# EAGLE design blinken-v2 (EAGLE 6.6.0)
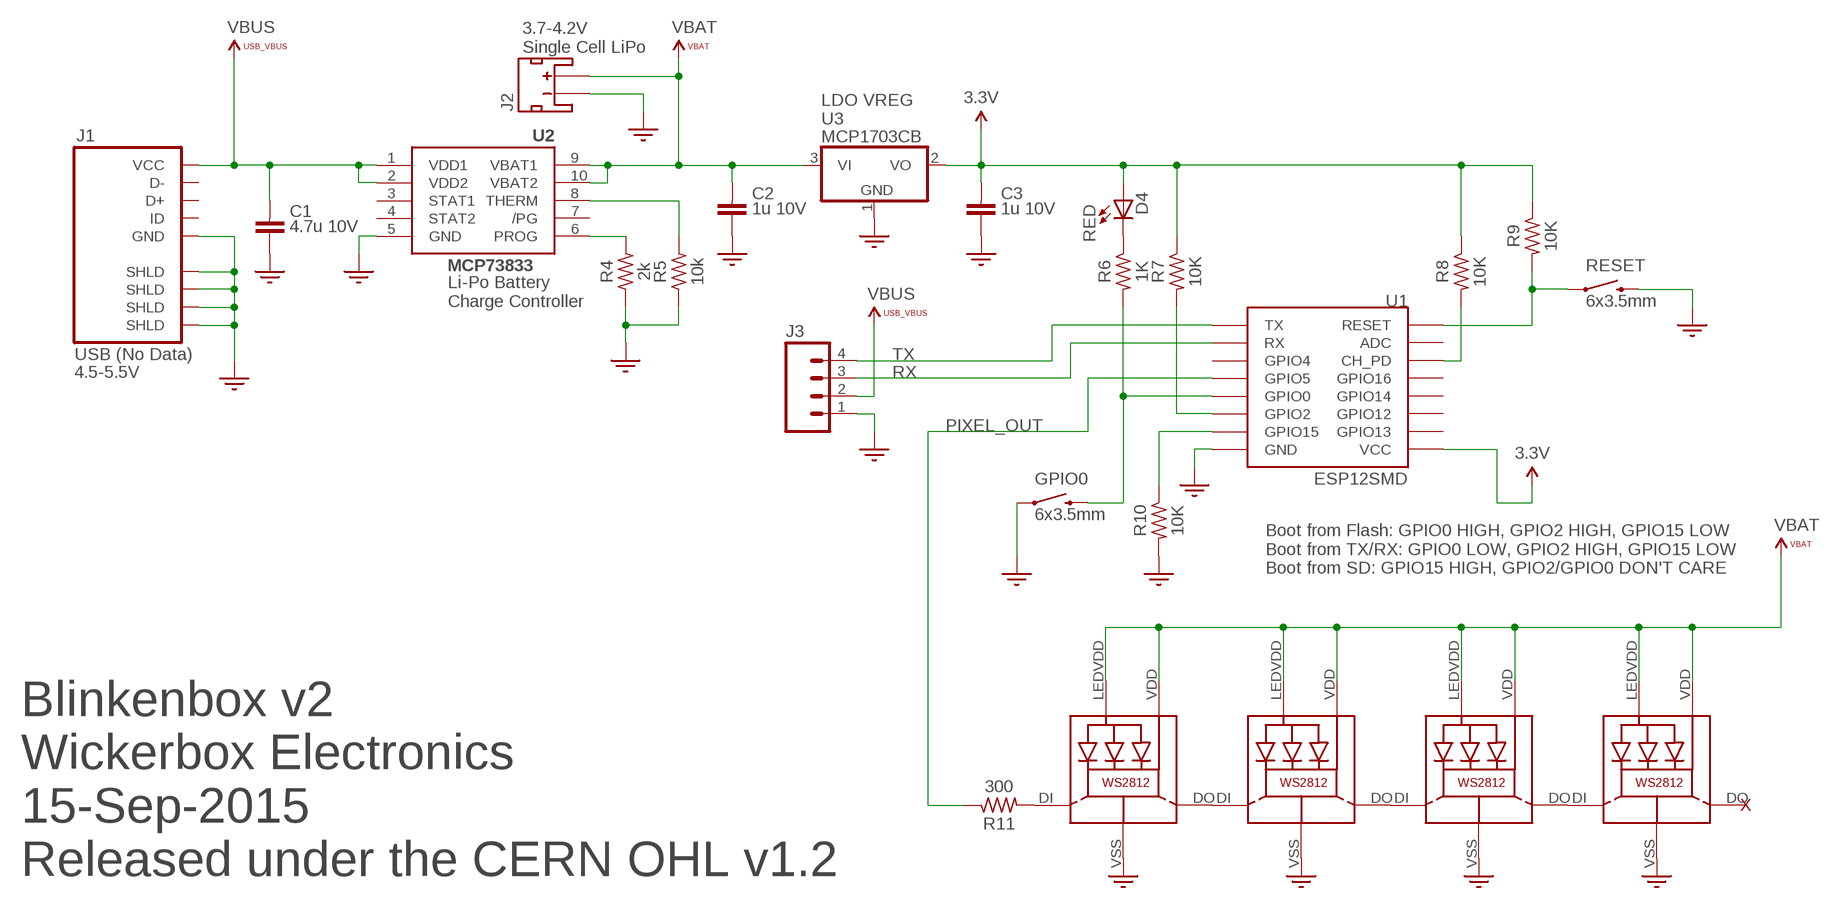
[diagram p0: schematic, sheet 1]

## Parts
C1  4.7u 10V  CAP-0805  [RLC-0805]
C2  1u 10V  CAP-0603  [RLC-0603]
C3  1u 10V  CAP-0603  [RLC-0603]
D4  RED  BG1111C  [LED0603]
GPIO0  6x3.5mm  SWITCH-MOMENTARY-2SMD-1101NE  [TACTILE-SWITCH-1101NE]
J1  USB (No Data)  ZX62D-B-5P8  [ZX62D-B-5P8]
J2  JST_2MM_MALE  [JST-2-SMD]
J3  M041X04_NO_SILK  [1X04_NO_SILK]
LED1  WS2812  [WS2812]
LED2  WS2812  [WS2812]
LED3  WS2812  [WS2812]
LED4  WS2812  [WS2812]
R4  2k  RES-0402  [RLC-0402]
R5  10k  RES-0402  [RLC-0402]
R6  1K  RES-0402  [RLC-0402]
R7  10K  RES-0402  [RLC-0402]
R8  10K  RES-0402  [RLC-0402]
R9  10K  RES-0402  [RLC-0402]
R10  10K  RES-0402  [RLC-0402]
R11  300  RES-0402  [RLC-0402]
RESET  6x3.5mm  SWITCH-MOMENTARY-2SMD-1101NE  [TACTILE-SWITCH-1101NE]
U1  ESP12SMD  [ESP12_SMD]
U2  MCP73833-UN  [MSOP10]
U3  MCP1703CB  [SOT23]

## Nets
3.3V: C3.2 D4.A R7.1 R8.1 R9.1 U1.VCC U3.2(VO)
!RESET: R9.2 RESET.1 U1.RESET
CH_PD: R8.2 U1.CH_PD
GND: C1.2 C2.1 C3.1 GPIO0.1 J1.P5(GND) J1.P$1(SHLD) J1.P$2(SHLD) J1.P$3(SHLD) J1.P$4(SHLD) J2.1(-) J3.1 LED1.VSS(GND) LED2.VSS(GND) LED3.VSS(GND) LED4.VSS(GND) R4.1 R5.1 R10.2 RESET.2 U1.GND U2.5(GND) U3.1(GND)
GPIO0: GPIO0.2 R6.2 U1.GPIO0
GPIO2: R7.2 U1.GPIO2
GPIO15: R10.1 U1.GPIO15
N$2: LED1.DO LED2.DI
N$3: D4.C R6.1
N$4: LED2.DO LED3.DI
N$5: LED3.DO LED4.DI
N$7: LED1.DI R11.2
PIXEL_OUT: R11.1 U1.GPIO5
PROG: R4.2 U2.6(PROG)
RX: J3.3 U1.RX
THERM: R5.2 U2.8(THERM)
TX: J3.4 U1.TX
VBROUTE: C2.2 J2.2(+) LED1.LEDVDD LED1.VDD LED2.LEDVDD LED2.VDD LED3.LEDVDD LED3.VDD LED4.LEDVDD LED4.VDD U2.9(VBAT1) U2.10(VBAT2) U3.3(VI) ; supply symbol labelled VBAT
VBUS: C1.1 J1.P1(VCC) J3.2 U2.1(VDD1) U2.2(VDD2)
Unconnected: J1.P2(D-) J1.P3(D+) J1.P4(ID) J2.NC1(PAD1) J2.NC2(PAD2) LED4.DO U1.ADC U1.GPIO4 U1.GPIO12 U1.GPIO13 U1.GPIO14 U1.GPIO16 U2.3(STAT1) U2.4(STAT2) U2.7(/PG)

## Notes on the sheet
- 3.7-4.2V
  Single Cell LiPo
- LDO VREG
- Li-Po Battery
  Charge Controller
- 4.5-5.5V
- Boot from Flash: GPIO0 HIGH, GPIO2 HIGH, GPIO15 LOW
  Boot from TX/RX: GPIO0 LOW, GPIO2 HIGH, GPIO15 LOW
  Boot from SD: GPIO15 HIGH, GPIO2/GPIO0 DON'T CARE
- X
- Blinkenbox v2
  Wickerbox Electronics
  15-Sep-2015
  Released under the CERN OHL v1.2

## Library data of the parts
C1 = max-viz:CAP-0805
C2 C3 = max-viz:CAP-0603
D4 = max-viz:BG1111C
GPIO0 RESET = SparkFun-Electromechanical:SWITCH-MOMENTARY-2: Various NO switches- pushbuttons, reed, etc; PROD_ID: SWCH-00815
J1 = con-hirose-microusb:ZX62D-B-5P8
J2 = SparkFun-Connectors:JST_2MM_MALE: Mates to single-cell LiPo batteries. CONN-08352; PROD_ID: CONN-08352
J3 = SparkFun-Connectors:M04: Header 4 Standard 4-pin 0.1" header. Use with straight break away headers (SKU : PRT-00116), right angle break away headers (PRT-00553), swiss pins (PRT-00743), machine pins (PRT-00117), and female headers (PRT-00115). Molex polarized connector foot print use with SKU : PRT-08231 with associated crimp pins and housings. 1MM SMD Version SKU: PRT-10208
LED1-LED4 = adafruit:WS2812
R4-R11 = max-viz:RES-0402
U1 = esp8266modules:ESP12: ESP8266 Wifi module 12
U2 = adafruit:MCP73833
U3 = linear:MCP1703: 250 mA, 16V, Low Quiescent Current LDO Regulator Source: http://ww1.microchip.com/downloads/en/DeviceDoc/22049b.pdf

## Board
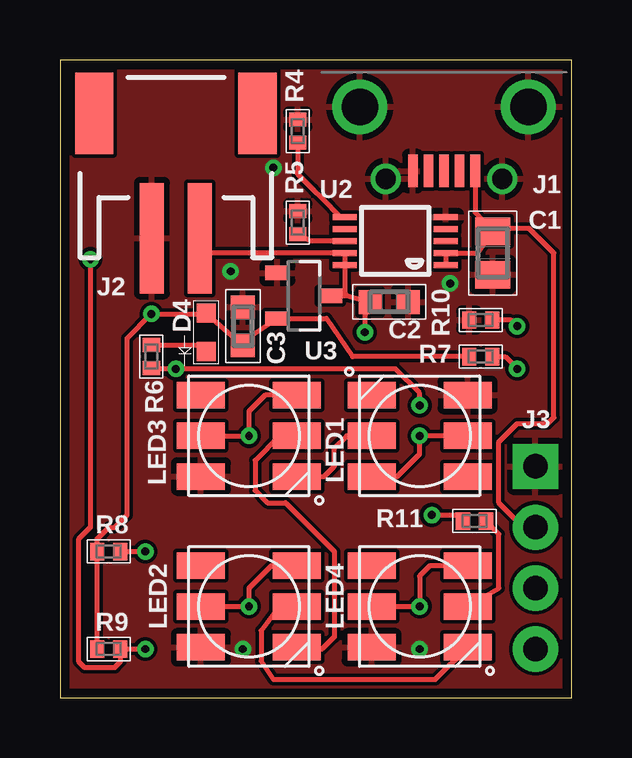
[diagram p1: board, top side]
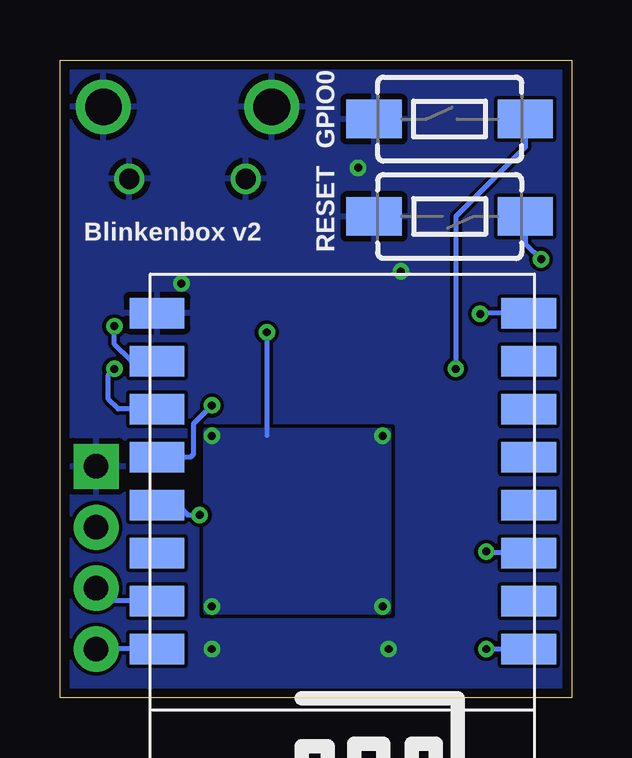
[diagram p2: board, bottom side, seen from below]

Size 21.32 x 26.59 mm. Coordinates in mm from the lower left corner, seen from the top.
Outline: 0,0 21.32,0 21.32,26.59 0,26.59 0,0
Copper layers (1*16): Top 0.0356mm / dielectric 1.5011mm / Bottom 0.0356mm
Design rules "oshpark-2layer": minimum track width 6mil, minimum drill 13mil, track to track 6mil, track to pad 6mil, pad to pad 6mil, via to via 6mil, smd to smd 6mil, copper to edge 15mil, drill to drill 6mil, minimum pad ring 7mil, minimum via ring 7mil, stop-mask expansion 4mil, vias tented up to drill 0mil, thermal gap 10mil

### Footprints (pad centres in the part's own frame; a part is rotated, then mirrored left to right if it is on the bottom)
RLC-0805 = smd 1.15 x 1.45: 1 -0.9,0; 2 0.9,0
RLC-0603 = smd 0.95 x 1: 1 0.8,0; 2 -0.8,0
LED0603 = smd 0.8 x 0.8: A 0,0.8; C 0,-0.8
TACTILE-SWITCH-1101NE = smd 2.3 x 1.6: 1 -3.15,0; 2 3.15,0
ZX62D-B-5P8 = smd 0.4 x 1.35: P1 -1.3,2.675; P2 -0.65,2.675; P3 0,2.675; P4 0.65,2.675; P5 1.3,2.675 | drill 1.524: P$1 3.51,0; P$2 -3.51,0 | drill 0.838: P$3 -2.425,3; P$4 2.425,3
JST-2-SMD = smd 1 x 4.6: 1 -1,-3.7; 2 1,-3.7 | smd 1.6 x 3.4: NC1 -3.4,1.5; NC2 3.4,1.5
1X04_NO_SILK = drill 1.016 pad 1.88 square: 1 0,0 | drill 1.016 pad 1.88: 2 2.54,0; 3 5.08,0; 4 7.62,0
WS2812 = smd 2 x 1.1: DI 2,0; DO 2,-1.7; LEDVDD -2,0; NC -2,1.7; VDD 2,1.7; VSS -2,-1.7
RLC-0402 = smd 0.59 x 0.72: 1 -0.48,0; 2 0.48,0
ESP12_SMD = smd 2.286 x 1.27: ADC -7.874,3.842; CH_PD -7.874,1.842; GND 7.62,-8.158; GPIO0 7.62,-2.158; GPIO2 7.62,-4.158; GPIO4 7.62,1.842; GPIO5 7.62,-0.158; GPIO12 -7.874,-4.158; GPIO13 -7.874,-6.158; GPIO14 -7.874,-2.158; GPIO15 7.62,-6.158; GPIO16 -7.874,-0.158; RESET -7.874,5.842; RX 7.62,3.842; TX 7.62,5.842; VCC -7.874,-8.158
MSOP10 = smd 0.25 x 1: 1 -1,-2.113; 2 -0.5,-2.113; 3 0,-2.113; 4 0.5,-2.113; 5 1,-2.113; 6 1,2.113; 7 0.5,2.113; 8 0,2.113; 9 -0.5,2.113; 10 -1,2.113
SOT23 = smd 0.6 x 1: 1 -0.95,-1.1; 2 0.95,-1.1; 3 0,1.1

### Placement (x,y rotation side)
C1  18.03,18.54 270 top
C2  13.72,16.51 0 top
C3  7.62,15.49 90 top
D4  6.1,15.24 0 top
GPIO0  5.08,24.13 0 bottom
J1  16,24.64 180 top
J2  4.83,22.86 0 top
J3  19.81,9.65 270 top
LED1  14.99,3.81 0 top
LED2  7.87,3.81 0 top
LED3  7.87,10.92 0 top
LED4  14.99,10.92 180 top
R4  9.91,23.62 270 top
R5  9.91,19.81 270 top
R6  3.81,14.22 270 top
R7  17.53,14.22 0 top
R8  2.03,6.1 0 top
R9  2.03,2.03 0 top
R10  17.53,15.75 180 top
R11  17.27,7.37 0 top
RESET  5.08,20.07 180 bottom
U1  9.65,7.87 180 bottom
U2  13.97,19.05 90 top
U3  10.16,16.76 270 top

### Tracks (layer width: path | path; a pad name or v marks a point on that pad's centre or on a via)
3.3V  (via drill 0.33)
  Top 0.203: 9.13,15.75 U3.2 | U3.2 7.91,15.05 C3.2 6.36,15.78 D4.A 6.06,16 v3.81,16 2.79,14.99 2.79,7.62 2.29,7.11 2.03,7.11 1.55,6.63 R8.1 R9.1 | R7.1 12.19,14.22 11.11,15.81 U3.2
  Bottom 0.203: U1.VCC 3.78,16.03 v3.81,16
!RESET  (via drill 0.33)
  Top 0.203: v3.56,2.03 R9.2 2.54,2 2.54,1.52 2.29,1.27 1.02,1.27 0.76,1.52 0.76,6.6 1.27,7.11 v1.27,18.29
  Bottom 0.203: v3.56,2.03 U1.RESET | RESET.1 1.93,18.95 v1.27,18.29
CH_PD  (via drill 0.33)
  Top 0.203: R8.2 v3.56,6.1
  Bottom 0.203: U1.CH_PD 3.49,6.03 v3.56,6.1
GND  (via drill 0.33)
  other vias: 14.99,2.03 7.62,2.03 16.26,17.27 8.89,22.1 7.11,17.78
  pour Bottom (rank 2): 0,-0.25 21.59,-0.25 21.59,26.67 0,26.67
  pour Top: 0,-0.25 21.59,-0.25 21.59,26.67 0,26.67
GPIO0  (via drill 0.33)
  Top 0.203: v14.99,12.19 14.99,12.7 13.97,13.72 v4.83,13.72 3.84,13.72 R6.2
  Bottom 0.203: U1.GPIO0 15.88,10.03 15.75,10.16 15.75,11.43 v14.99,12.19 | GPIO0.2 1.93,22.96 4.83,20.07 v4.83,13.72
GPIO2  (via drill 0.33)
  Top 0.203: R7.2 18.54,14.22 v19.05,13.72
  Bottom 0.203: U1.GPIO2 18.89,12.03 19.3,12.45 19.3,13.46 v19.05,13.72
GPIO15  (via drill 0.33)
  Top 0.203: v19.05,15.49 18.8,15.75 R10.1
  Bottom 0.203: U1.GPIO15 18.35,14.03 19.05,14.73 v19.05,15.49
N$2
  Top 0.203: LED2.DI 9.14,3.81 8.38,2.79 8.38,1.52 8.89,0.76 15.64,0.76 LED1.DO
N$3
  Top 0.203: R6.1 5.83,14.7 D4.C
N$4
  Top 0.203: LED3.DI 9.14,10.92 8.13,9.91 8.13,8.64 8.64,8.13 9.4,8.13 11.43,6.1 11.43,2.54 10.92,2.03 9.95,2.03 LED2.DO
N$5
  Top 0.203: LED3.DO 11,9.22 11.43,9.65 11.43,10.41 11.94,10.92 LED4.DI
N$7
  Top 0.203: LED1.DI 18.29,4.57 18.29,6.83 R11.2
PIXEL_OUT  (via drill 0.33)
  Top 0.203: v15.49,7.62 16.54,7.62 R11.1
  Bottom 0.203: U1.GPIO5 16.41,8.03 16,7.62 v15.49,7.62
PROG
  Top 0.203: R4.2 9.91,21.84 10.54,21.21 10.92,20.83 11.7,20.05 U2.6
RX
  Bottom 0.203: U1.RX 19.27,4.03 J3.3
THERM
  Top 0.203: U2.8 10.44,19.05 R5.2
TX
  Bottom 0.203: U1.TX J3.4
VBROUTE  (via drill 0.33)
  Top 0.203: J2.2 5.93,18.55 U2.9 U2.10 11.86,16.84 11.94,16.76 | LED1.LEDVDD v14.99,3.81 14.99,5.08 15.42,5.51 LED1.VDD | LED4.LEDVDD v14.99,10.92 14.99,10.16 14.05,9.22 LED4.VDD | LED3.LEDVDD v7.87,10.92 7.87,11.94 8.56,12.62 LED3.VDD | LED2.LEDVDD v7.87,3.81 7.87,4.57 8.81,5.51 LED2.VDD | U3.3 11.94,16.76 | 11.94,16.76 C2.2 12.73,15.97 12.7,15.97 v12.7,15.24
  Bottom 0.203: v12.7,15.24 12.7,10.92
  pour Bottom: 7.62,11.18 7.62,3.56 15.24,3.56 15.24,11.18
VBUS
  Top 0.203: U2.1 U2.2 17.4,18.55 C1.1 | J1.P1 17.3,20.23 C1.1 | J3.2 19.3,7.11 18.29,8.13 18.29,10.67 19.05,11.43 20.32,11.43 20.57,11.68 20.57,18.54 19.56,19.56 18.15,19.56 C1.1

### Text on the board
bPlace: Blinkenbox v2